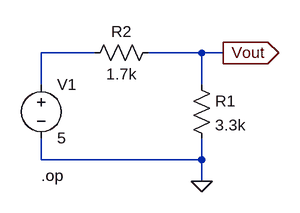
[diagram p0: schematic VoltageDivider.asc]
VoltageDivider.asc, the LTspice schematic file:
Version 4
SHEET 1 880 680
WIRE 112 64 32 64
WIRE 272 64 192 64
WIRE 304 64 272 64
WIRE 32 112 32 64
WIRE 272 112 272 64
WIRE 32 224 32 192
WIRE 272 224 272 192
WIRE 272 224 32 224
WIRE 272 256 272 224
FLAG 272 256 0
FLAG 304 64 Vout
IOPIN 304 64 Out
SYMBOL res 256 96 R0
SYMATTR InstName R1
SYMATTR Value 3.3k
SYMBOL res 208 48 R90
WINDOW 0 0 56 VBottom 2
WINDOW 3 32 56 VTop 2
SYMATTR InstName R2
SYMATTR Value 1.7k
SYMBOL voltage 32 96 R0
WINDOW 123 0 0 Left 0
WINDOW 39 0 0 Left 0
SYMATTR InstName V1
SYMATTR Value 5
TEXT 32 248 Left 2 !.op

The netlist it stands for:
* VoltageDivider.asc
R1 Vout 0 3.3k
R2 Vout N001 1.7k
V1 N001 0 5
.op
.backanno
.end